# EasyEDA schematic 1-Schematic_HF Upconverter (SMD).json

## Sheets
1 HF Upconverter (SMD): Power circuit: TITLE: HF Upconverter (SMD): Power circuit; REV: 12.22.EE; Date: 2018-11-05; Sheet: 1/3; Drawn By: IgrikXD
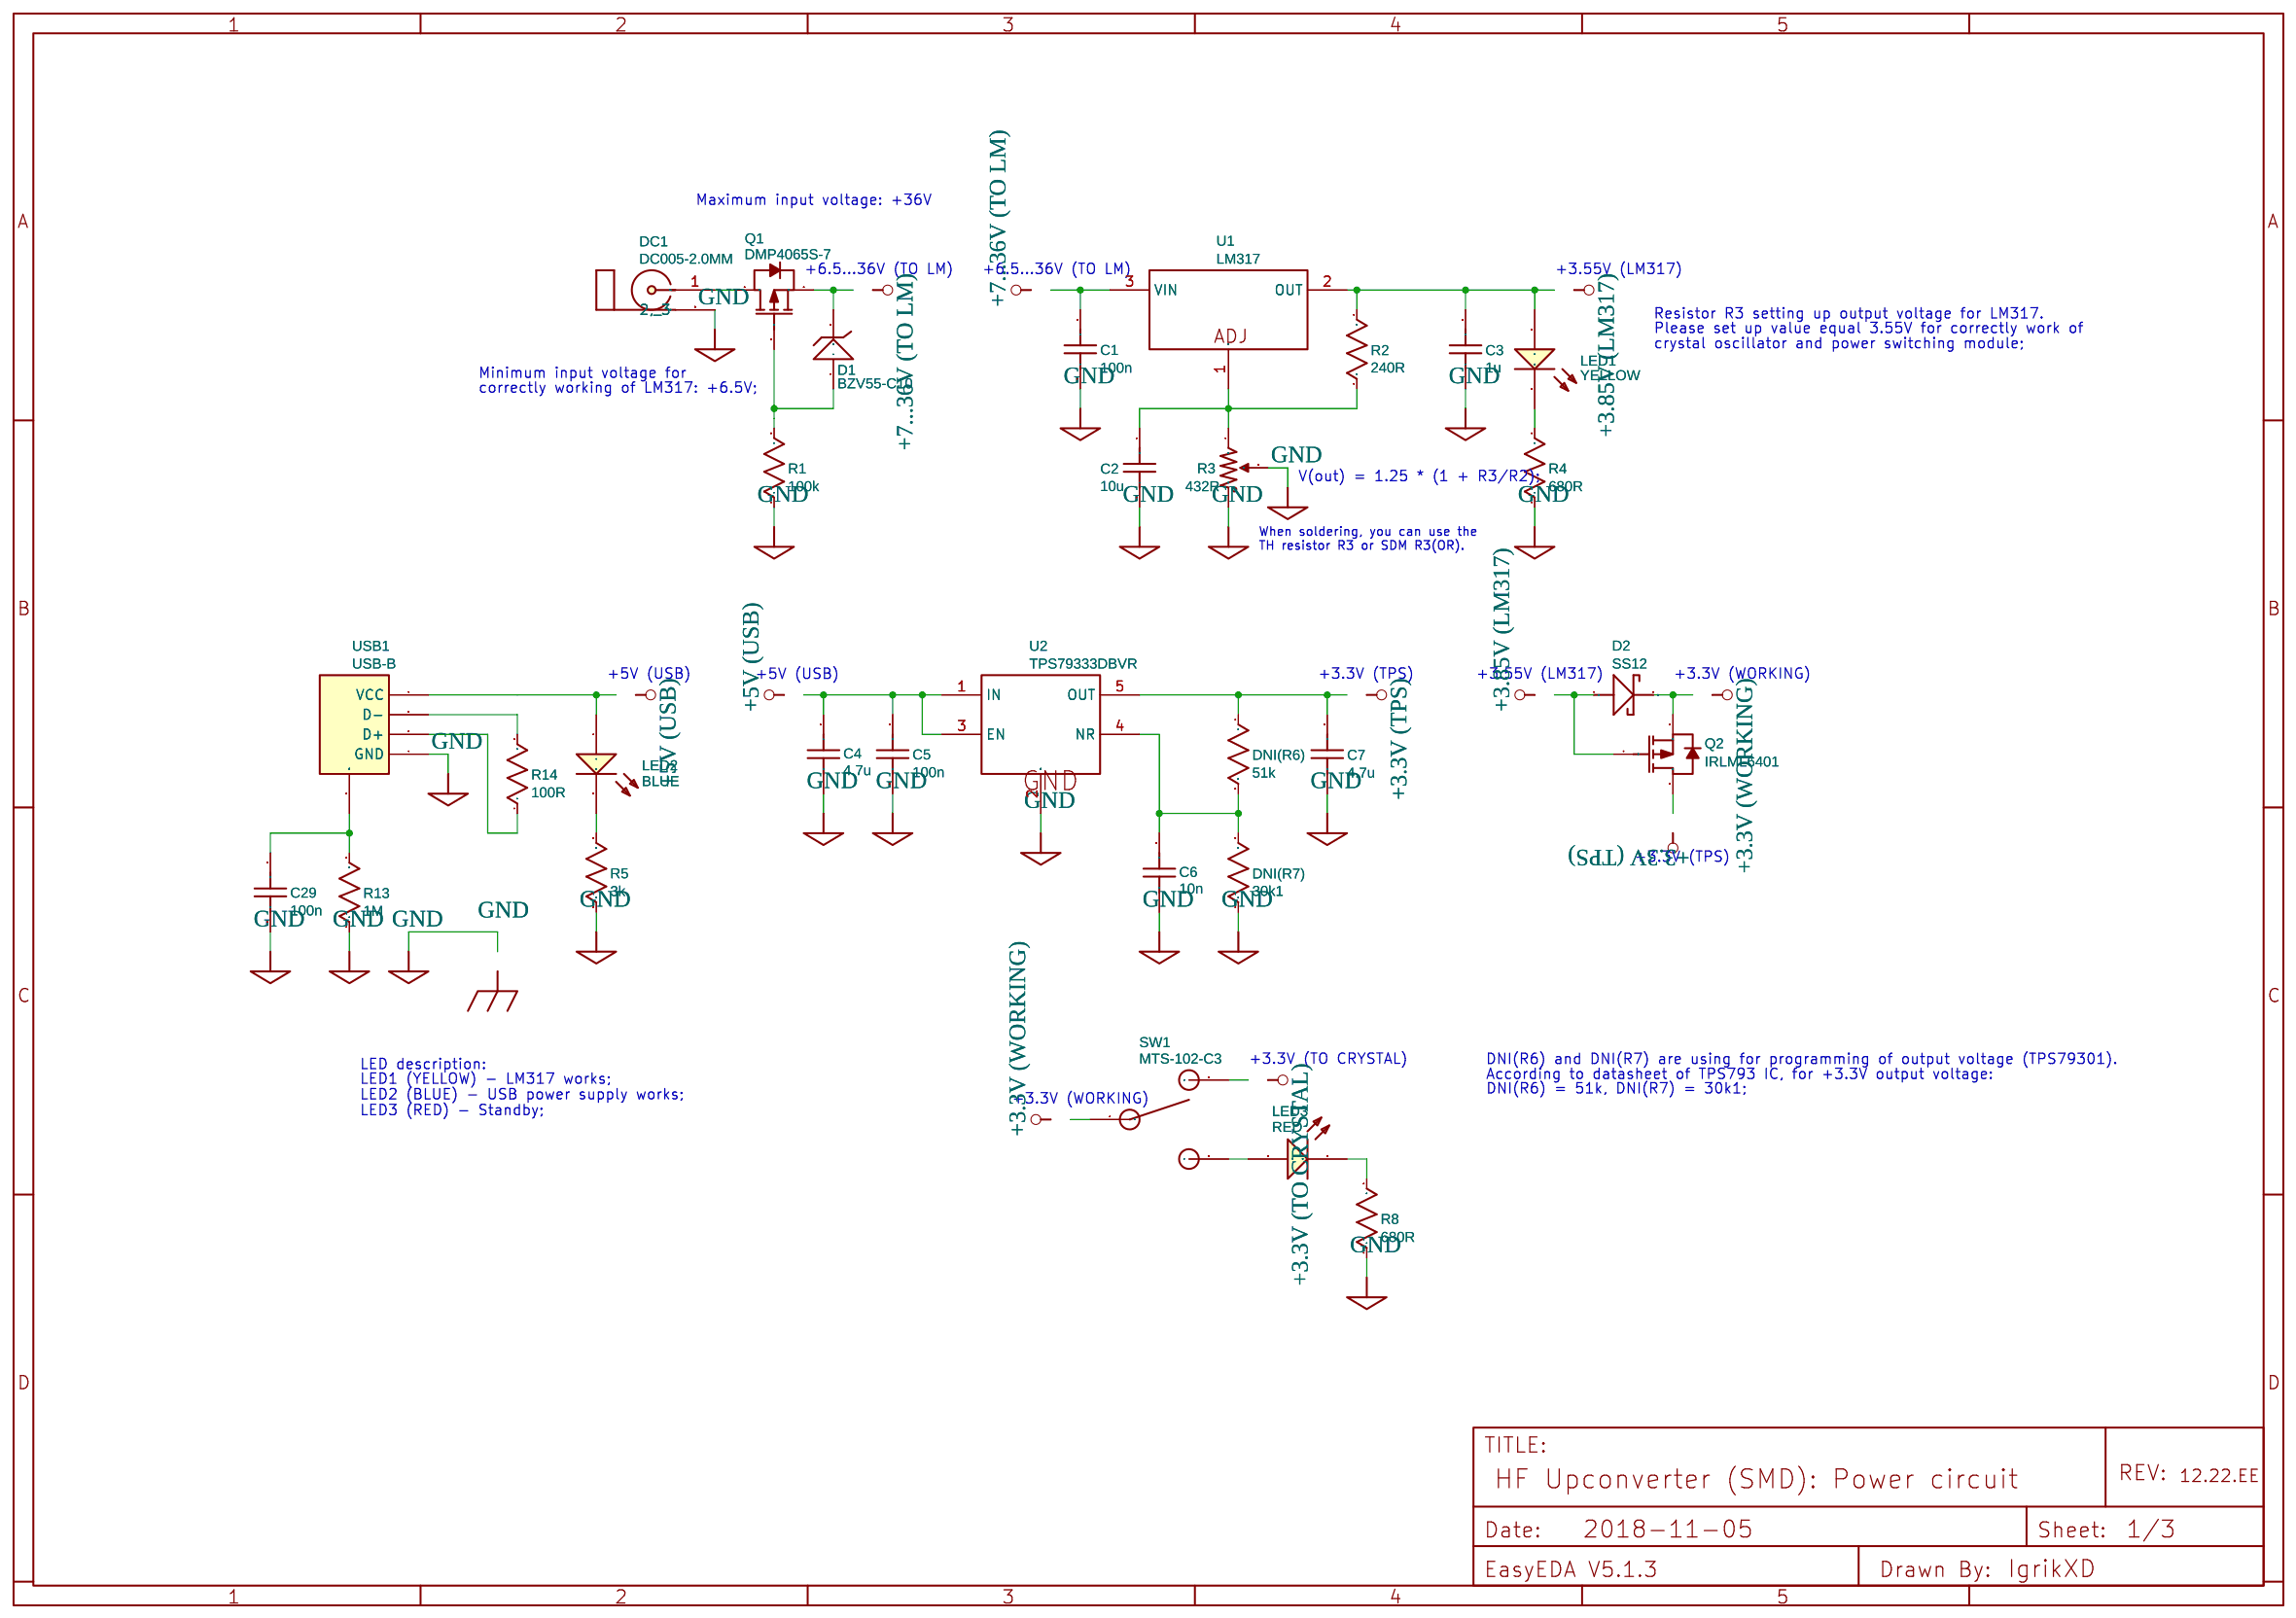
[diagram p0: HF Upconverter (SMD): Power circuit]
2 HF Upconverter (SMD): Crystal oscillator: TITLE: HF Upconverter (SMD): Crystal oscillator; Sheet: 2/3
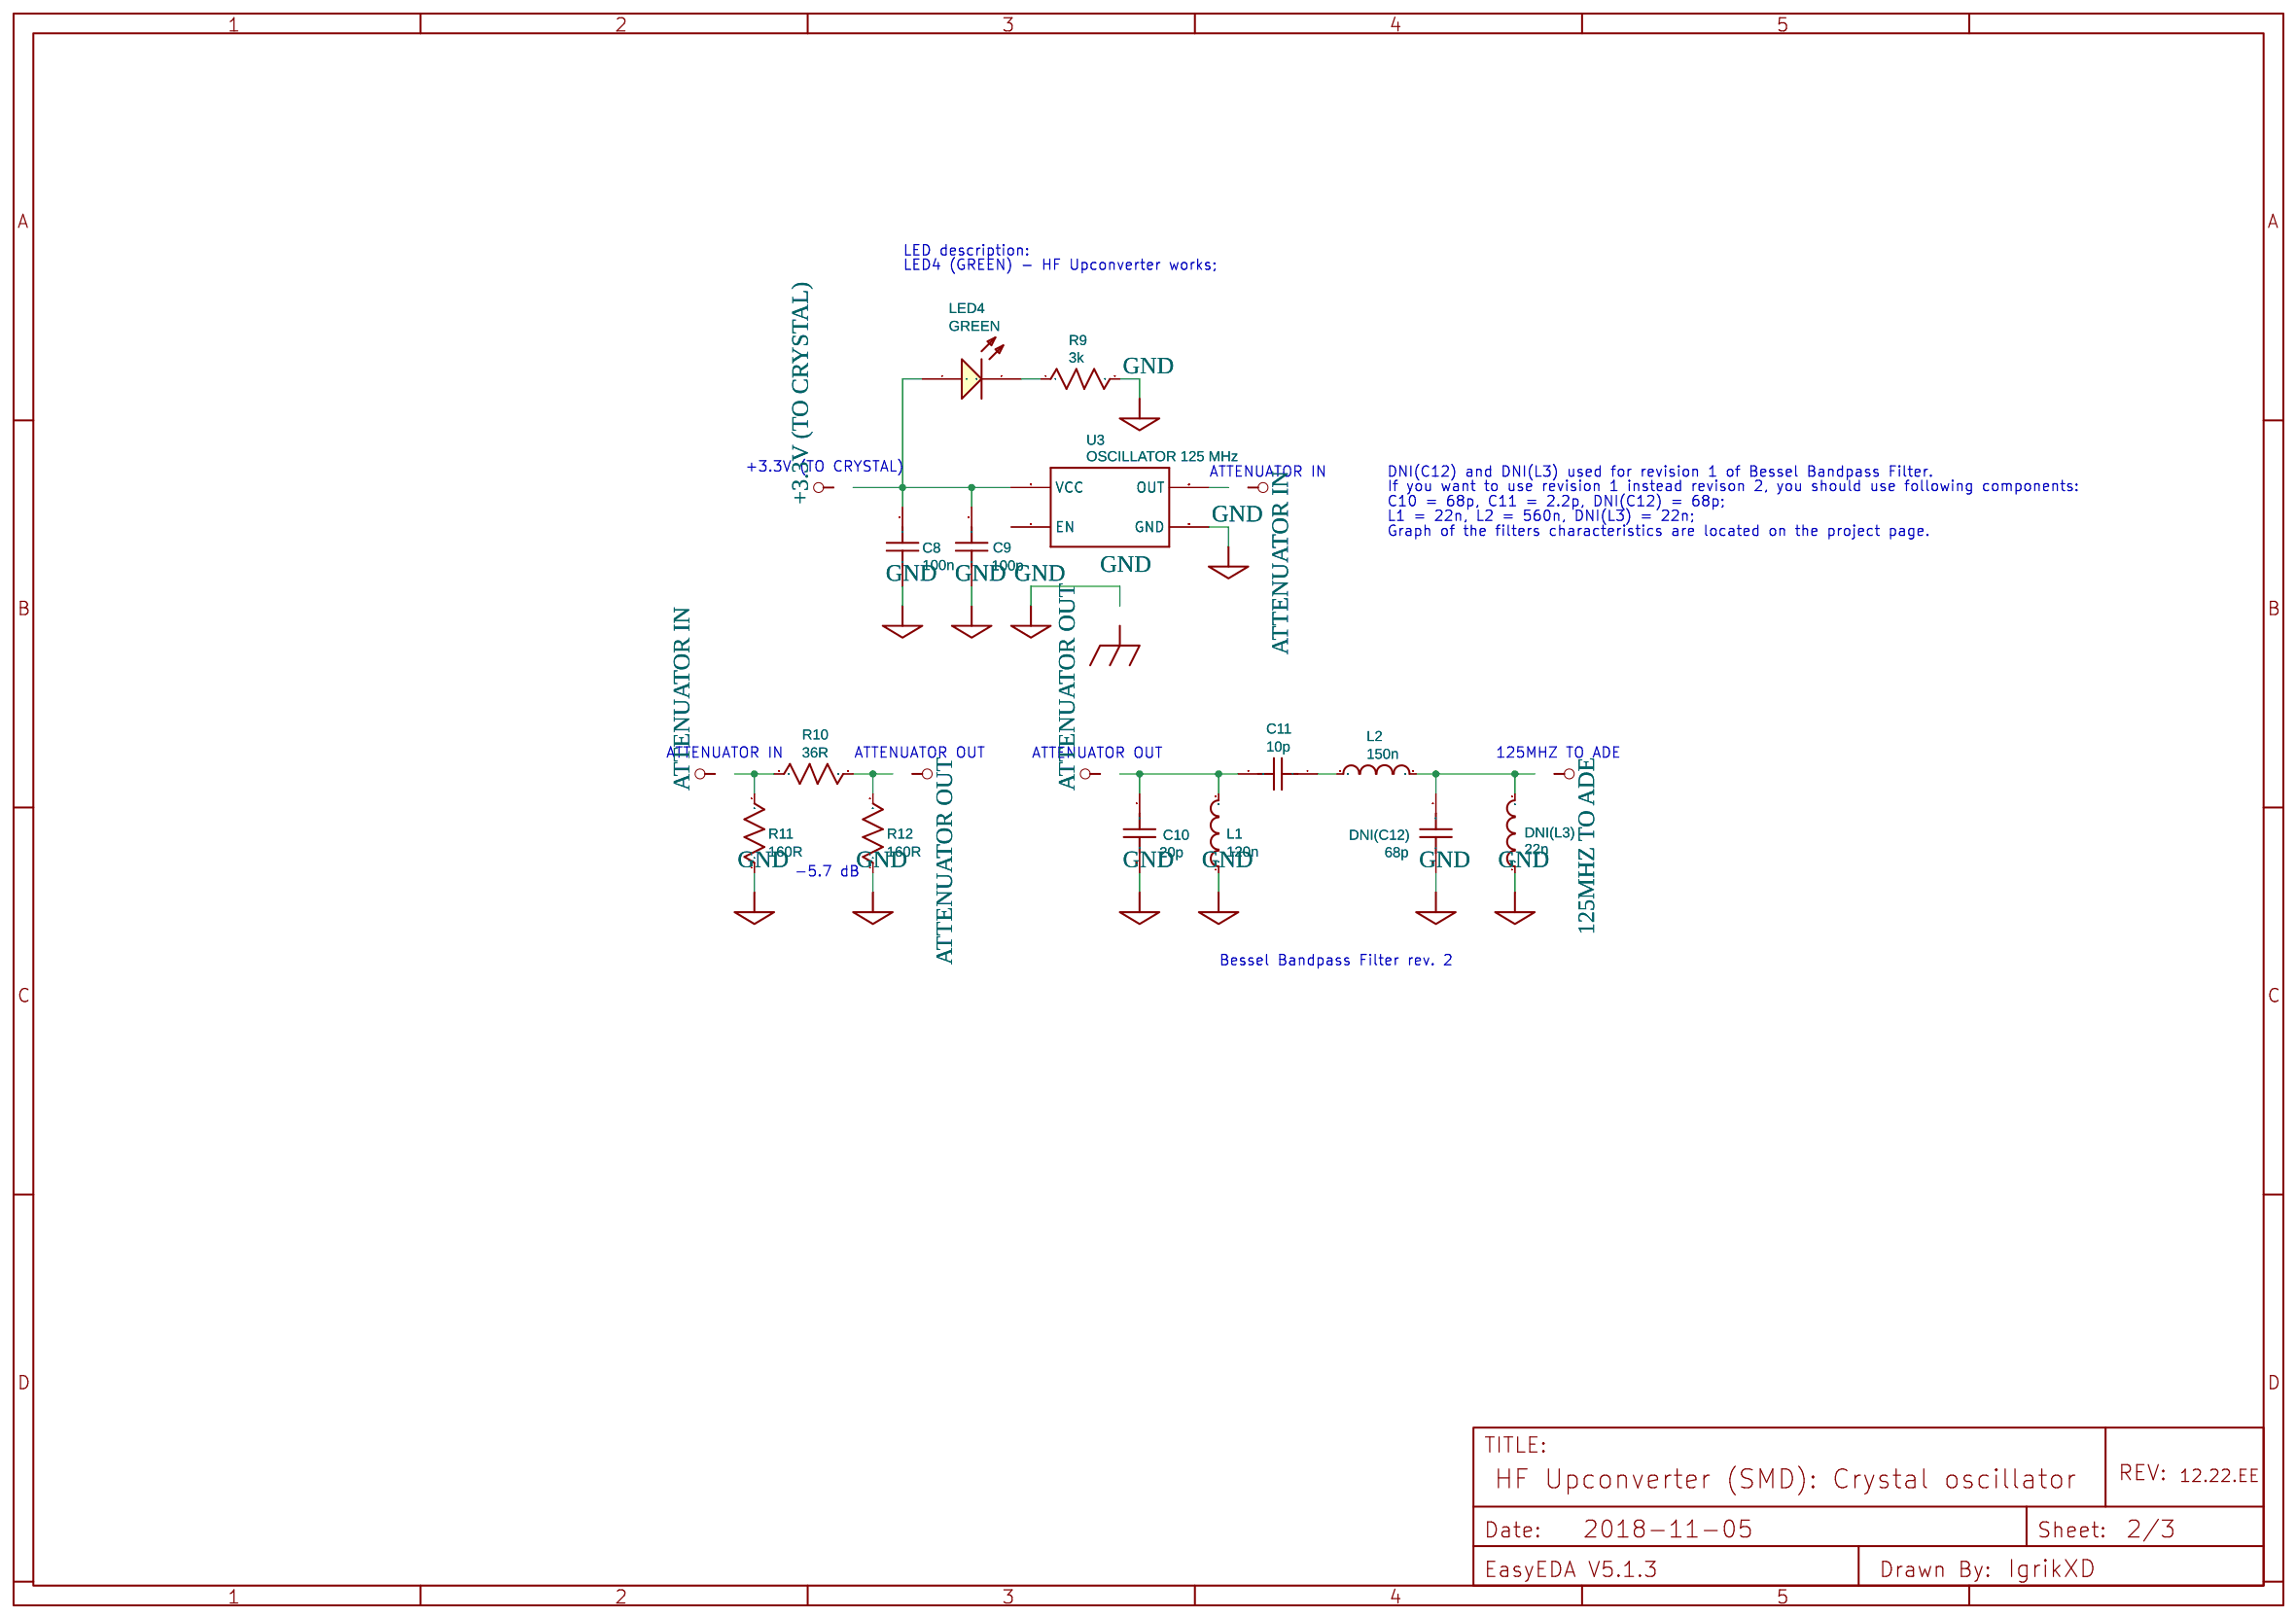
[diagram p1: HF Upconverter (SMD): Crystal oscillator]
3 HF Upconverter (SMD): Mixer with filters: TITLE: HF Upconverter (SMD): Mixer with filters; Sheet: 3/3
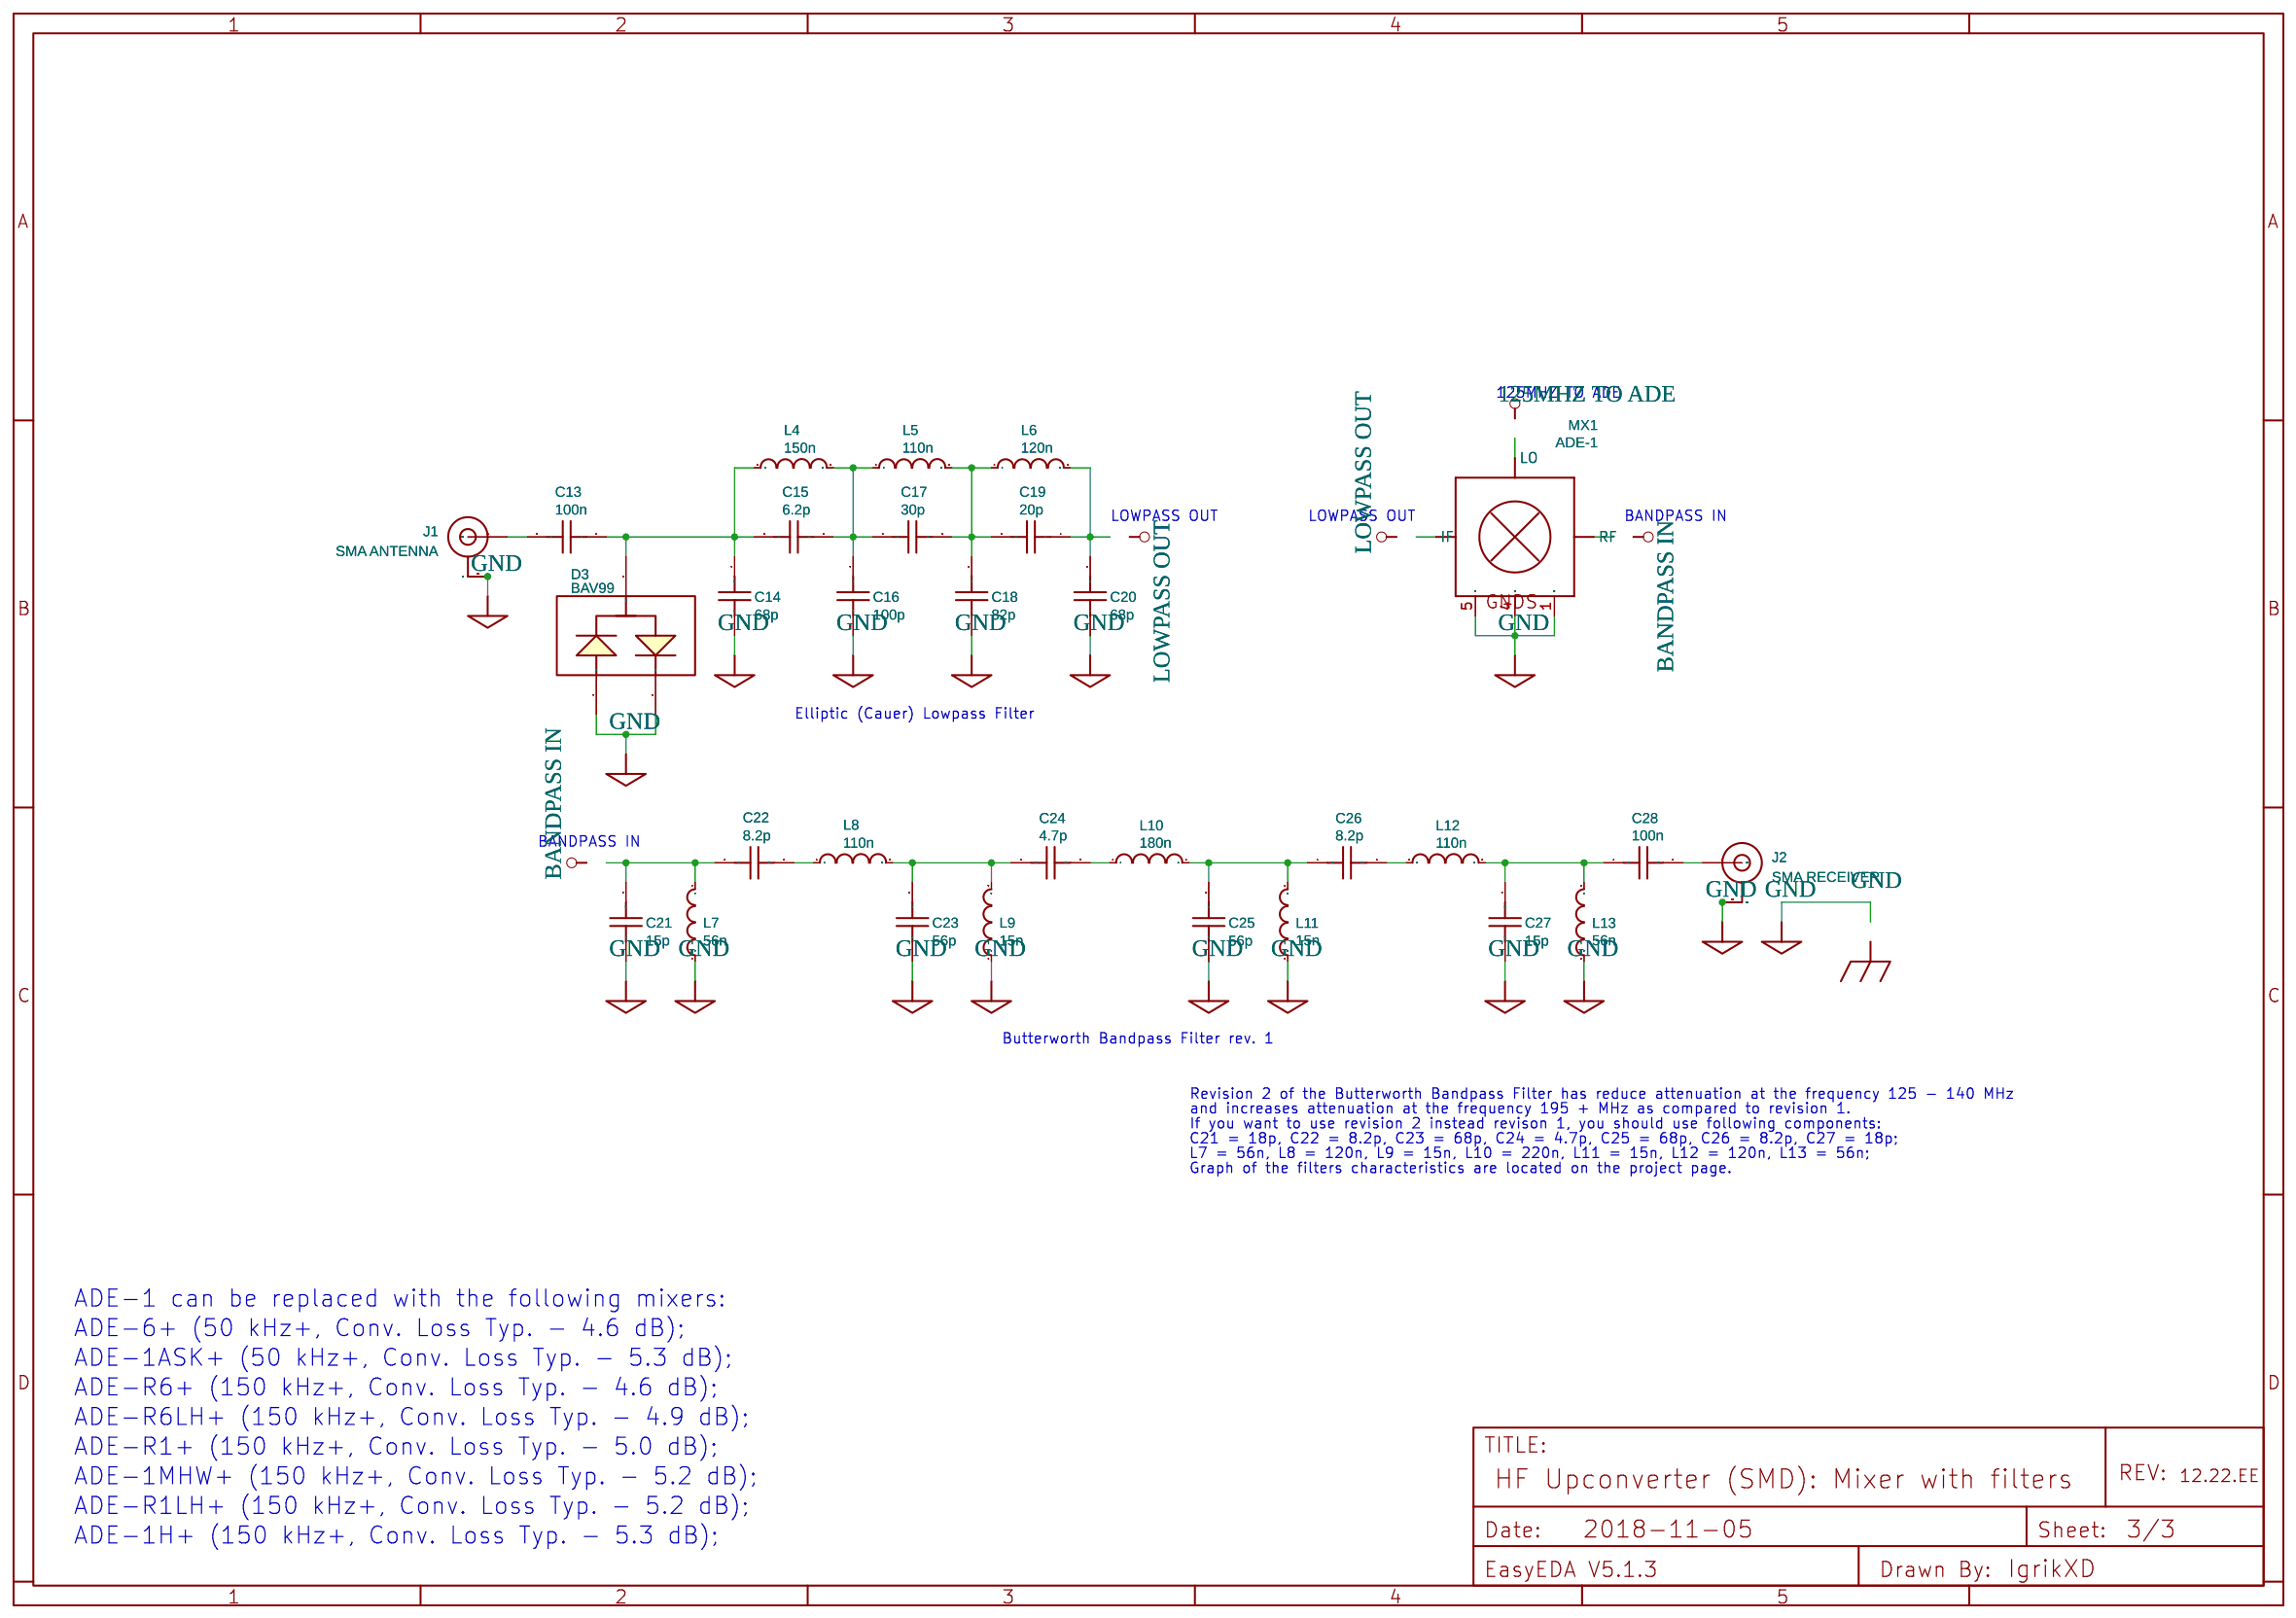
[diagram p2: HF Upconverter (SMD): Mixer with filters]

## Parts
sheet HF Upconverter (SMD): Crystal oscillator
C8  100n  [0805]
C9  100p  [0805]
C10  20p  [0805]
C11  10p  [0805]
DNI(C12)  68p  [0805]
DNI(L3)  22n  [0805]
L1  120n  [0805]
L2  150n  [0805]
LED4  GREEN  [LED-0805]
R9  3k  [0805]
R10  36R  [0805]
R11  160R  [0805]
R12  160R  [0805]
U3  OSCILLATOR 125 MHz  [CRYSTAL-SMD-7X5]
sheet HF Upconverter (SMD): Mixer with filters
C13  100n  [0805]
C14  68p  [0805]
C15  6.2p  [0805]
C16  100p  [0805]
C17  30p  [0805]
C18  82p  [0805]
C19  20p  [0805]
C20  68p  [0805]
C21  15p  [0805]
C22  8.2p  [0805]
C23  56p  [0805]
C24  4.7p  [0805]
C25  56p  [0805]
C26  8.2p  [0805]
C27  15p  [0805]
C28  100n  [0805]
D3  BAV99  [SOT-23-3]
J1  SMA ANTENNA  [SMA-EDGE]
J2  SMA RECEIVER  [SMA-EDGE]
L4  150n  [0805]
L5  110n  [0805]
L6  120n  [0805]
L7  56n  [0805]
L8  110n  [0805]
L9  15n  [0805]
L10  180n  [0805]
L11  15n  [0805]
L12  110n  [0805]
L13  56n  [0805]
MX1  ADE-1  [CD636]
sheet HF Upconverter (SMD): Power circuit
C1  100n  [0805]
C2  10u  [0805]
C3  1u  [0805]
C4  4.7u  [0805]
C5  100n  [0805]
C6  10n  [0805]
C7  4.7u  [0805]
C29  100n  [0805]
D1  BZV55-C10  [SOD-80C]
D2  SS12  [DO214AC]
DC1  DC005-2.0MM  [DC-5020]
DNI(R6)  51k  [0805]
DNI(R7)  30k1  [0805]
LED1  YELLOW  [LED-0805]
LED2  BLUE  [LED-0805]
LED3  RED  [LED-0805]
Q1  DMP4065S-7  [SOT-23(SOT-23-3)]
Q2  IRLML6401  [SOT-23(SOT-23-3)]
R1  100k  [0805]
R2  240R  [0805]
R3  432R  [RES-ADJ_3296W]
R4  680R  [0805]
R5  3k  [0805]
R8  680R  [0805]
R13  1M  [0805]
R14  100R  [0805]
SW1  MTS-102-C3  [MTS-102-C3]
U1  LM317  [TO-252-2]
U2  TPS79333DBVR  [SOT23-5]
USB1  USB-B  [USB TYPE B]

## Library data of the parts
C1 C5 C8 C13 C28 C29 = Capacitor: Manufacturer Part: 08055C104JAT2A; Supplier: LCSC; Manufacturer: AVX; Supplier Part: C129175
C9 C16 = Capacitor: Manufacturer Part: C2012C0G2A101JT000N; Supplier: LCSC; Manufacturer: TDK; Supplier Part: C76633
C10 C19 = Capacitor: Manufacturer Part: 0805CG200J500NT; Supplier: LCSC; Manufacturer: FH; Supplier Part: C94472
C11 = Capacitor: Manufacturer Part: 0805N100J500; Supplier: LCSC; Manufacturer: WTC; Supplier Part: C123640
C14 C20 DNI(C12) = Capacitor: Supplier: LCSC; Manufacturer: WTC; Manufacturer Part: 0805N680J500; Supplier Part: C123650
DNI(L3) = Inductor: Manufacturer Part: BKW0805UC022JGT; Supplier: LCSC; Manufacturer: FH-BK; Supplier Part: C107467
L1 L6 = Inductor: Manufacturer Part: BKW0805UCR12JGT; Supplier: LCSC; Manufacturer: FH-BK; Supplier Part: C98546
L2 L4 = Inductor: Manufacturer Part: BKW0805UCR15JGT; Supplier: LCSC; Manufacturer: FH-BK; Supplier Part: C107465
LED4 = -: Supplier: LCSC; Manufacturer: EVERLIGHT; Manufacturer Part: 17-21/GHC-YR1S2/3T; Supplier Part: C73546
R5 R9 = Resistor: Manufacturer Part: RC0805FR-073KL; Supplier: LCSC; Manufacturer: YAGEO; Supplier Part: C126350
R10 = Resistor: Manufacturer Part: RTT0536R0FTP; Supplier: LCSC; Manufacturer: RALEC; Supplier Part: C104270
R11 R12 = Resistor: Manufacturer Part: CR0805F81600G; Supplier: LCSC; Manufacturer: LIZ; Supplier Part: C101494
U3 = -: catid: 20; Contributor: SparkFun; Manufacturer Part: X1G004491000200; Supplier: LCSC; Manufacturer: Seiko Epson; Supplier Part: C70533
C15 = Capacitor: Manufacturer Part: 0805CG6R2C500NT; Supplier: LCSC; Manufacturer: FH; Supplier Part: C1831
C17 = Capacitor: Manufacturer Part: CC0805JRNPO9BN300; Supplier: LCSC; Manufacturer: YAGEO; Supplier Part: C107114
C18 = Capacitor: Manufacturer Part: 0805CG820J500NT; Supplier: LCSC; Manufacturer: FH; Supplier Part: C1841
C21 = Capacitor: Supplier: LCSC; Manufacturer: SAMSUNG; Manufacturer Part: CL21C150JBANNNC; Supplier Part: C1794
C22 = Capacitor: Supplier: LCSC; Manufacturer: FH; Manufacturer Part: 0805CG8R2C500NT; Supplier Part: C1840
C23 C25 = Capacitor: Manufacturer Part: 0805CG560J500NT; Supplier: LCSC; Manufacturer: FH; Supplier Part: C1828
C24 = Capacitor: Manufacturer Part: 0805CG4R7C500NT; Supplier: LCSC; Manufacturer: FH; Supplier Part: C1820
C26 = Capacitor: Manufacturer Part: 0805CG8R2C500NT; Supplier: LCSC; Manufacturer: FH; Supplier Part: C1840
C27 = Capacitor: Manufacturer Part: CL21C150JBANNNC; Supplier: LCSC; Manufacturer: SAMSUNG; Supplier Part: C1794
D3 = -: Supplier: LCSC; Manufacturer: SEMTECH; Contributor: IgrikXD; Supplier Part: C83868
J1 = -: catid: 20; Contributor: Pinoccio; Manufacturer Part: ANKX01.0093; Manufacturer: RFsister; Supplier: LCSC; Supplier Part: C129604
J2 = -: catid: 20; Contributor: Pinoccio; Manufacturer Part: ANKX01.0093; Supplier: LCSC; Manufacturer: RFsister; Supplier Part: C129604
L5 L8 L12 = Inductor: Manufacturer Part: LQW18ANR11G00D; Supplier: LCSC; Manufacturer: MuRata; Supplier Part: C113130
L7 = Inductor: Supplier: LCSC; Manufacturer: FH-BK; Manufacturer Part: BKW0805UC056JGT; Supplier Part: C98534
L9 = Inductor: Supplier: LCSC; Manufacturer Part: BKW0805UC015JGT; Manufacturer: FH-BK; Supplier Part: C107468
L10 = Inductor: Manufacturer Part: BKW0805UCR18JGT; Supplier: LCSC; Manufacturer: FH-BK; Supplier Part: C107466
L11 = Inductor: Manufacturer Part: BKW0805UC015JGT; Supplier: LCSC; Manufacturer: FH-BK; Supplier Part: C107468
L13 = Inductor: Manufacturer Part: BKW0805UC056JGT; Supplier: LCSC; Manufacturer: FH-BK; Supplier Part: C98534
MX1 = -: catid: 20; Supplier: Mini Circuits; Manufacturer: Mini Circuits; Manufacturer Part: NOT DEFINED; Supplier Part: ADE-1+
C2 = Capacitor: Manufacturer Part: GRM21BR71A106KE51L; Supplier: LCSC; Manufacturer: MuRata; Supplier Part: C86038
C3 = Capacitor: Manufacturer Part: CL21B105KAFNFNE; Supplier: LCSC; Manufacturer: SAMSUNG; Supplier Part: C1712
C4 C7 = Capacitor: Manufacturer Part: 0805X475K250NT; Supplier: LCSC; Manufacturer: FH; Supplier Part: C67142
C6 = Capacitor: Manufacturer Part: 0805CG103J500NT; Supplier: LCSC; Manufacturer: FH; Supplier Part: C63849
D1 = -: catid: 20; Supplier: LCSC; Manufacturer: NXP Semicon; Supplier Part: C108431
D2 = -: Contributor: SparkFun; Supplier: LCSC; Manufacturer: Semtech; Supplier Part: C84580
DC1 = -: Supplier Part: C16214; Supplier: LCSC; Manufacturer: BOOMELE; Manufacturer Part: DC-005 5.5-2.0; Contributor: IgrikXD
DNI(R6) = Resistor: Manufacturer Part: RTT055102FTP; Supplier: LCSC; Manufacturer: RALEC; Supplier Part: C104376
DNI(R7) = Resistor: Manufacturer Part: RTT053012FTP; Supplier: LCSC; Manufacturer: RALEC; Supplier Part: C104208
LED1 = -: Supplier: LCSC; Manufacturer: EVERLIGHT; Manufacturer Part: 17-215UYC/S530-A3/TR8; Supplier Part: C72036
LED2 = -: Supplier: LCSC; Manufacturer: EVERLIGHT; Manufacturer Part: 17-21/BHC-AP1Q2/3T; Supplier Part: C99870
LED3 = -: Supplier: LCSC; Manufacturer: EVERLIGHT; Manufacturer Part: 17-215/R6C-AQ1R2B/3T; Supplier Part: C86865
Q1 = -: Supplier: LCSC; Manufacturer: Diodes Incorporated; Supplier Part: C182476
Q2 = -: Supplier: LCSC; Manufacturer: International Rectifier; Manufacturer Part: IRLML6401TRPBF; Supplier Part: C3034
R1 = Resistor: Manufacturer Part: RC0805FR-07100KL; Supplier: LCSC; Manufacturer: YAGEO; Supplier Part: C96346
R2 = Resistor: Manufacturer Part: CR0805F82400G; Supplier: LCSC; Manufacturer: LIZ; Supplier Part: C101586
R3 = Potentiometer: K(%): 50; Manufacturer Part: 3296W-1-102LF; Supplier: LCSC; Manufacturer: BOURNS; Supplier Part: C57089
R4 = Resistor: Manufacturer Part: RC0805FR-07680RL; Manufacturer: YAGEO; Supplier: LCSC; Supplier Part: C114549
R8 = Resistor: Manufacturer Part: RC0805FR-07680RL; Supplier: LCSC; Manufacturer: YAGEO; Supplier Part: C114549
R13 = Resistor: Manufacturer Part: RC0805FR-071ML; Supplier: LCSC; Manufacturer: YAGEO; Supplier Part: C107700
R14 = Resistor: Manufacturer Part: RTT051000FTP; Supplier: LCSC; Manufacturer: RALEC; Supplier Part: C103902
SW1 = -: Contributor: snhunter; sourceId: LjTecMmIi
U1 = -: Supplier: LCSC; Manufacturer: UTC; Manufacturer Part: LM317AG-TN3-R; Supplier Part: C75510
U2 = -: Single Output High PSRR LDO, 200 mA, Fixed 3.3 V Output, 2.7 to 5.5 V Input, 5-pin SOT-23 (DBV), -40 to 85 degC, Green (RoHS  no SbBr); catid: 20; Supplier: LCSC; Manufacturer: TI; Supplier Part: C9840
USB1 = -: Supplier: LCSC; Manufacturer: LCSC; Manufacturer Part: USB BFemale90 White plastic; Supplier Part: C46393

## Nets
+3.3V (TO CRYSTAL): C8.2 C9.2 LED4.1(A) SW1.3 U3.P$4(VCC)
+3.3V (TPS): C7.2 DNI(R6).1 Q2.3(D) U2.5(OUT)
+3.3V (WORKING): D2.2(C) Q2.2(S) SW1.2
+3.85V (LM317): C3.2 D2.1(A) LED1.1(A) Q2.1(G) R2.2 U1.2(OUT)
+5V (USB): C4.1 C5.2 LED2.1(A) U2.1(IN) U2.3(EN) USB1.1(VCC)
GND: C1.1 C2.1 C3.1 C4.2 C5.1 C6.1 C7.1 C8.1 C9.1 C10.1 C14.1 C16.2 C18.1 C20.1 C21.1 C23.1 C25.1 C27.1 C29.1 D3.1 D3.2 DC1.2(2, 3) DC1.3 DNI(C12).1 DNI(L3).1 DNI(R7).1 J1.GND@0(GND) J1.GND@1(GND) J1.GND@2(GND) J1.GND@3(GND) J2.GND@0(GND) J2.GND@1(GND) J2.GND@2(GND) J2.GND@3(GND) L1.1 L7.1 L9.1 L11.1 L13.1 MX1.1(GND) MX1.4(GND) MX1.5(GND) R1.1 R3.2(3) R3.3(2) R4.1 R5.1 R8.1 R9.2 R11.1 R12.1 R13.1 U2.2(GND) U3.P$2(GND) USB1.4(GND)
125MHZ TO ADE: DNI(C12).2 DNI(L3).2 L2.2 MX1.6(LO)
+7...36V (TO LM): C1.2 D1.2(C) Q1.2(S) U1.3(VIN)
ATTENUATOR IN: R10.1 R11.2 U3.P$3(OUT)
ATTENUATOR OUT: C10.2 C11.2 L1.2 R10.2 R12.2
BANDPASS IN: C21.2 C22.1 L7.2 MX1.3(RF)
LOWPASS OUT: C19.1 C20.2 L6.2 MX1.2(IF)
Net-(C2-2): C2.2 R2.1 R3.1 U1.1(ADJ)
Net-(C6-2): C6.2 DNI(R6).2 DNI(R7).2 U2.4(NR)
Net-(C11-1): C11.1 L2.1
Net-(C13-1): C13.1 C14.2 C15.2 D3.3 L4.1
Net-(C13-2): C13.2 J1.SIG(SIGNAL)
Net-(C15-1): C15.1 C16.1 C17.1 L4.2 L5.1
Net-(C17-2): C17.2 C18.2 C19.2 L5.2 L6.1
Net-(C22-2): C22.2 L8.1
Net-(C23-2): C23.2 C24.1 L8.2 L9.2
Net-(C24-2): C24.2 L10.1
Net-(C25-2): C25.2 C26.1 L10.2 L11.2
Net-(C26-2): C26.2 L12.1
Net-(C27-2): C27.2 C28.1 L12.2 L13.2
Net-(C28-2): C28.2 J2.SIG(SIGNAL)
Net-(C29-2): C29.2 R13.2 USB1.5(CASE)
Net-(D1-1): D1.1(A) Q1.1(G) R1.2
Net-(DC1-1): DC1.1(VCC) Q1.3(D)
Net-(LED1-2): LED1.2(C) R4.2
Net-(LED2-2): LED2.2(C) R5.2
Net-(LED3-1): LED3.1(A) SW1.1
Net-(LED3-2): LED3.2(C) R8.2
Net-(LED4-2): LED4.2(C) R9.1
Net-(R14-1): R14.1 USB1.3(D+)
Net-(R14-2): R14.2 USB1.2(D-)

Not connected (* = marked no-connect by the designer): U3 P$1(EN)

## Notes on the sheets
sheet 1
- Maximum input voltage: +36V
- +6.5...36V (TO LM)
- +6.5...36V (TO LM)
- +3.55V (LM317)
- Resistor R3 setting up output voltage for LM317.
- Please set up value equal 3.55V for correctly work of
- crystal oscillator and power switching module;
- Minimum input voltage for
- correctly working of LM317: +6.5V;
- V(out) = 1.25 * (1 + R3/R2);
- When soldering, you can use the
  TH resistor R3 or SDM R3(OR).
- +5V (USB)
- +5V (USB)
- +3.3V (TPS)
- +3.55V (LM317)
- +3.3V (WORKING)
- +3.3V (TPS)
- LED description:
- LED1 (YELLOW) - LM317 works;
- +3.3V (TO CRYSTAL)
- According to datasheet of TPS793 IC, for +3.3V output voltage:
- DNI(R6) and DNI(R7) are using for programming of output voltage (TPS79301).
- LED2 (BLUE) - USB power supply works;
- +3.3V (WORKING)
- DNI(R6) = 51k, DNI(R7) = 30k1;
- LED3 (RED) - Standby;
sheet 2
- LED description:
- LED4 (GREEN) - HF Upconverter works;
- +3.3V (TO CRYSTAL)
- ATTENUATOR IN
- DNI(C12) and DNI(L3) used for revision 1 of Bessel Bandpass Filter.
- If you want to use revision 1 instead revison 2, you should use following components:
- C10 = 68p, C11 = 2.2p, DNI(C12) = 68p;
- L1 = 22n, L2 = 560n, DNI(L3) = 22n;
- Graph of the filters characteristics are located on the project page.
- ATTENUATOR IN
- ATTENUATOR OUT
- ATTENUATOR OUT
- 125MHZ TO ADE
- -5.7 dB
- Bessel Bandpass Filter rev. 2
sheet 3
- 125MHZ TO ADE
- LOWPASS OUT
- LOWPASS OUT
- BANDPASS IN
- Elliptic (Cauer) Lowpass Filter
- BANDPASS IN
- Butterworth Bandpass Filter rev. 1
- Revision 2 of the Butterworth Bandpass Filter has reduce attenuation at the frequency 125 - 140 MHz
- If you want to use revision 2 instead revison 1, you should use following components:
- and increases attenuation at the frequency 195 + MHz as compared to revision 1.
- C21 = 18p, C22 = 8.2p, C23 = 68p, C24 = 4.7p, C25 = 68p, C26 = 8.2p, C27 = 18p;
- Graph of the filters characteristics are located on the project page.
- L7 = 56n, L8 = 120n, L9 = 15n, L10 = 220n, L11 = 15n, L12 = 120n, L13 = 56n;
- ADE-1 can be replaced with the following mixers:
- ADE-6+ (50 kHz+, Conv. Loss Typ. - 4.6 dB);
- ADE-1ASK+ (50 kHz+, Conv. Loss Typ. - 5.3 dB);
- ADE-R6+ (150 kHz+, Conv. Loss Typ. - 4.6 dB);
- ADE-R6LH+ (150 kHz+, Conv. Loss Typ. - 4.9 dB);
- ADE-R1+ (150 kHz+, Conv. Loss Typ. - 5.0 dB);
- ADE-1MHW+ (150 kHz+, Conv. Loss Typ. - 5.2 dB);
- ADE-R1LH+ (150 kHz+, Conv. Loss Typ. - 5.2 dB);
- ADE-1H+ (150 kHz+, Conv. Loss Typ. - 5.3 dB);
